# Altium schematic sheet Reefing-PD.SchDoc: Reefing System
size A4; DocumentNumber: Subtitle; Revision: V1.0; SheetNumber: 5; SheetTotal: 13; Author: Luca Jost; Subtitle: Power Distribution
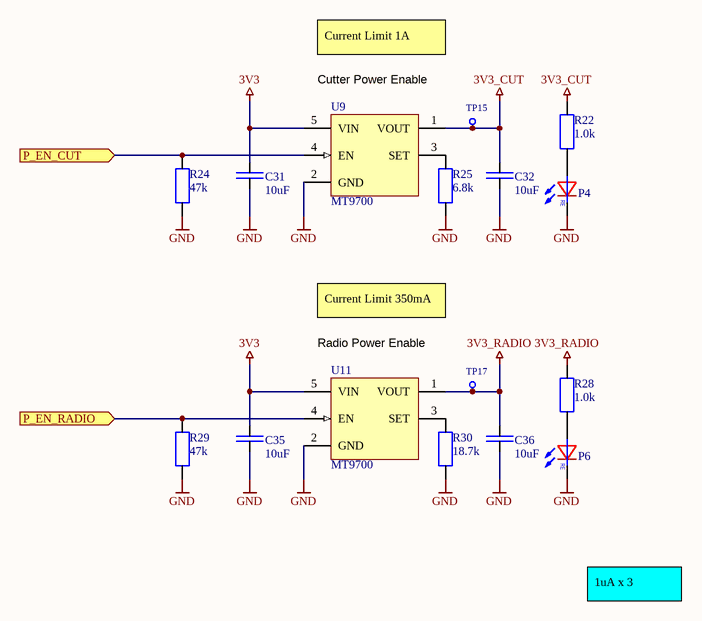
[diagram p0: Reefing-PD.SchDoc]

## Parts
C31  10uF  [SMD Keramikkondensator 0603]
C32  10uF  [SMD Keramikkondensator 0603]
C35  10uF  [SMD Keramikkondensator 0603]
C36  10uF  [SMD Keramikkondensator 0603]
P4  LED  [SMD LED 0603]  (value not drawn)
P6  LED  [SMD LED 0603]  (value not drawn)
R22  1.0k  [SMD Widerstand 0402]
R24  47k  [SMD Widerstand 0402]
R25  6.8k  [SMD Widerstand 0402]
R28  1.0k  [SMD Widerstand 0402]
R29  47k  [SMD Widerstand 0402]
R30  18.7k  [SMD Widerstand 0402]
TP15  X-TP  [SMD Testpoint 1mm]  (value not drawn)  (no BOM)
TP17  X-TP  [SMD Testpoint 1mm]  (value not drawn)  (no BOM)
U9  MT9700  [SMD IC SOT-23-5]
U11  MT9700  [SMD IC SOT-23-5]

## Ports
P_EN_CUT (in), P_EN_RADIO (in)

## Nets
3V3: C31.2 C35.2 U9.5(VIN) U11.5(VIN)
3V3_CUT: C32.2 R22.2 TP15.1 U9.1(VOUT)
3V3_RADIO: C36.2 R28.2 TP17.1 U11.1(VOUT)
GND: C31.1 C32.1 C35.1 C36.1 P4.K P6.K R24.1 R25.1 R29.1 R30.1 U9.2(GND) U11.2(GND)
P_EN_CUT: R24.2 U9.4(EN) ; port P_EN_CUT
P_EN_RADIO: R29.2 U11.4(EN) ; port P_EN_RADIO
NetP4_A: P4.A R22.1
NetP6_A: P6.A R28.1
NetR25_2: R25.2 U9.3(SET)
NetR30_2: R30.2 U11.3(SET)

## Notes on the sheet
- Cutter Power Enable
- Current Limit 1A
- Radio Power Enable
- Current Limit 350mA
- 1uA x 3
- Title
- Author:
- Subtitle
- Date:
- Rev:
- File:
- Sheet
- of
- (in symbol LED) RE

## Library data of the parts
C31 C32 C35 C36 = E6 - 10uF: SMD Ceramic Capacitor E6; Unit Price: 0.01; JLC: C70225
P4 P6 = LED: Color LED; JLC: C2286
R22 R28 = E24 - 1.0k: SMD Chip Resistor E24; Unit Price: 0.01; JLC: C11702
R24 R29 = E24 - 47k: SMD Chip Resistor E24; Unit Price: 0.01; JLC: C25792
R25 = E24 - 6.8k: SMD Chip Resistor E24; Unit Price: 0.01; JLC: C25917
R30 = E96 - 18.7k: SMD Chip Resistor E96; Unit Price: 0.01; JLC: C11476
TP15 TP17 = X-TP: Testpunkt; Unit Price: 0.00
U9 U11 = MT9700: Power Distribution Switch; ComponentLink1Description: Datasheet; ComponentLink1URL: https://datasheet.lcsc.com/lcsc/1809291208_XI-AN-Aerosemi-Tech-MT9700_C89855.pdf; JLC: C89855; Unit Price: 0.11